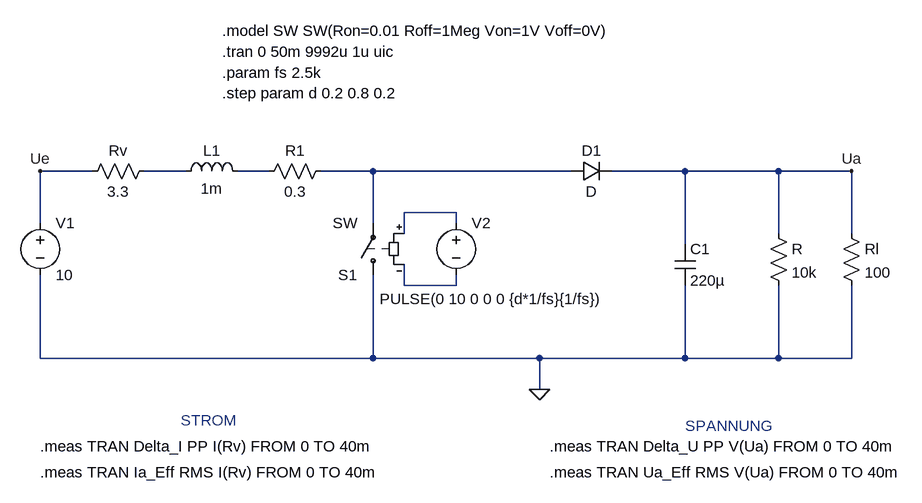
[diagram p0: schematic C4 HSS 1.asc]
C4 HSS 1.asc, the LTspice schematic file:
Version 4.1
SHEET 1 1840 920
WIRE -240 64 -320 64
WIRE -96 64 -160 64
WIRE 32 64 -16 64
WIRE 192 64 112 64
WIRE 496 64 192 64
WIRE 672 64 560 64
WIRE 816 64 672 64
WIRE 928 64 816 64
WIRE 320 128 240 128
WIRE -320 144 -320 64
WIRE 192 144 192 64
WIRE 320 144 320 128
WIRE 240 160 240 128
WIRE 816 160 816 64
WIRE 928 160 928 64
WIRE 672 176 672 64
WIRE 240 240 240 208
WIRE 320 240 320 224
WIRE 320 240 240 240
WIRE -320 352 -320 224
WIRE 192 352 192 224
WIRE 192 352 -320 352
WIRE 448 352 192 352
WIRE 672 352 672 240
WIRE 672 352 448 352
WIRE 816 352 816 240
WIRE 816 352 672 352
WIRE 928 352 928 240
WIRE 928 352 816 352
WIRE 448 400 448 352
FLAG -320 64 Ue
FLAG 928 64 Ua
FLAG 448 400 0
SYMBOL voltage -320 128 R0
SYMATTR InstName V1
SYMATTR Value 10
SYMBOL ind -112 80 R270
WINDOW 0 32 56 VTop 2
WINDOW 3 5 56 VBottom 2
SYMATTR InstName L1
SYMATTR Value 1m
SYMBOL diode 496 80 R270
WINDOW 0 32 32 VTop 2
WINDOW 3 0 32 VBottom 2
SYMATTR InstName D1
SYMBOL cap 656 176 R0
SYMATTR InstName C1
SYMATTR Value 220µ
SYMBOL res 912 144 R0
SYMATTR InstName Rl
SYMATTR Value 100
SYMBOL voltage 320 128 R0
WINDOW 3 -118 133 Left 2
SYMATTR Value PULSE(0 10 0 0 0 {d*1/fs}{1/fs})
SYMATTR InstName V2
SYMBOL sw 192 240 R180
SYMATTR InstName S1
SYMBOL res 800 144 R0
SYMATTR InstName R
SYMATTR Value 10k
SYMBOL res -144 48 R90
WINDOW 0 0 56 VBottom 2
WINDOW 3 32 56 VTop 2
SYMATTR InstName Rv
SYMATTR Value 3.3
SYMBOL res 128 48 R90
WINDOW 0 0 56 VBottom 2
WINDOW 3 32 56 VTop 2
SYMATTR InstName R1
SYMATTR Value 0.3
TEXT -40 -88 Left 2 !.param fs 2.5k
TEXT -40 -56 Left 2 !.step param d 0.2 0.8 0.2
TEXT -40 -152 Left 2 !.model SW SW(Ron=0.01 Roff=1Meg Von=1V Voff=0V)
TEXT -40 -120 Left 2 !.tran 0 50m 9992u 1u uic
TEXT -320 488 Left 2 !.meas TRAN Delta_I PP I(Rv) FROM 0 TO 40m
TEXT -320 528 Left 2 !.meas TRAN Ia_Eff RMS I(Rv) FROM 0 TO 40m
TEXT 464 488 Left 2 !.meas TRAN Delta_U PP V(Ua) FROM 0 TO 40m
TEXT 464 528 Left 2 !.meas TRAN Ua_Eff RMS V(Ua) FROM 0 TO 40m
TEXT -104 448 Left 2 ;STROM
TEXT 672 456 Left 2 ;SPANNUNG

The netlist it stands for:
* C4 HSS 1.asc
V1 Ue 0 10
L1 N001 N002 1m
D1 N003 Ua D
C1 Ua 0 220µ
Rl Ua 0 100
V2 N004 N005 PULSE(0 10 0 0 0 {d*1/fs}{1/fs})
S1 0 N003 N004 N005 SW
R Ua 0 10k
Rv N001 Ue 3.3
R1 N003 N002 0.3
.model D D
.lib standard.dio
.param fs 2.5k
.step param d 0.2 0.8 0.2
.model SW SW(Ron=0.01 Roff=1Meg Von=1V Voff=0V)
.tran 0 50m 9992u 1u uic
.meas TRAN Delta_I PP I(Rv) FROM 0 TO 40m
.meas TRAN Ia_Eff RMS I(Rv) FROM 0 TO 40m
.meas TRAN Delta_U PP V(Ua) FROM 0 TO 40m
.meas TRAN Ua_Eff RMS V(Ua) FROM 0 TO 40m
* STROM
* SPANNUNG
.backanno
.end